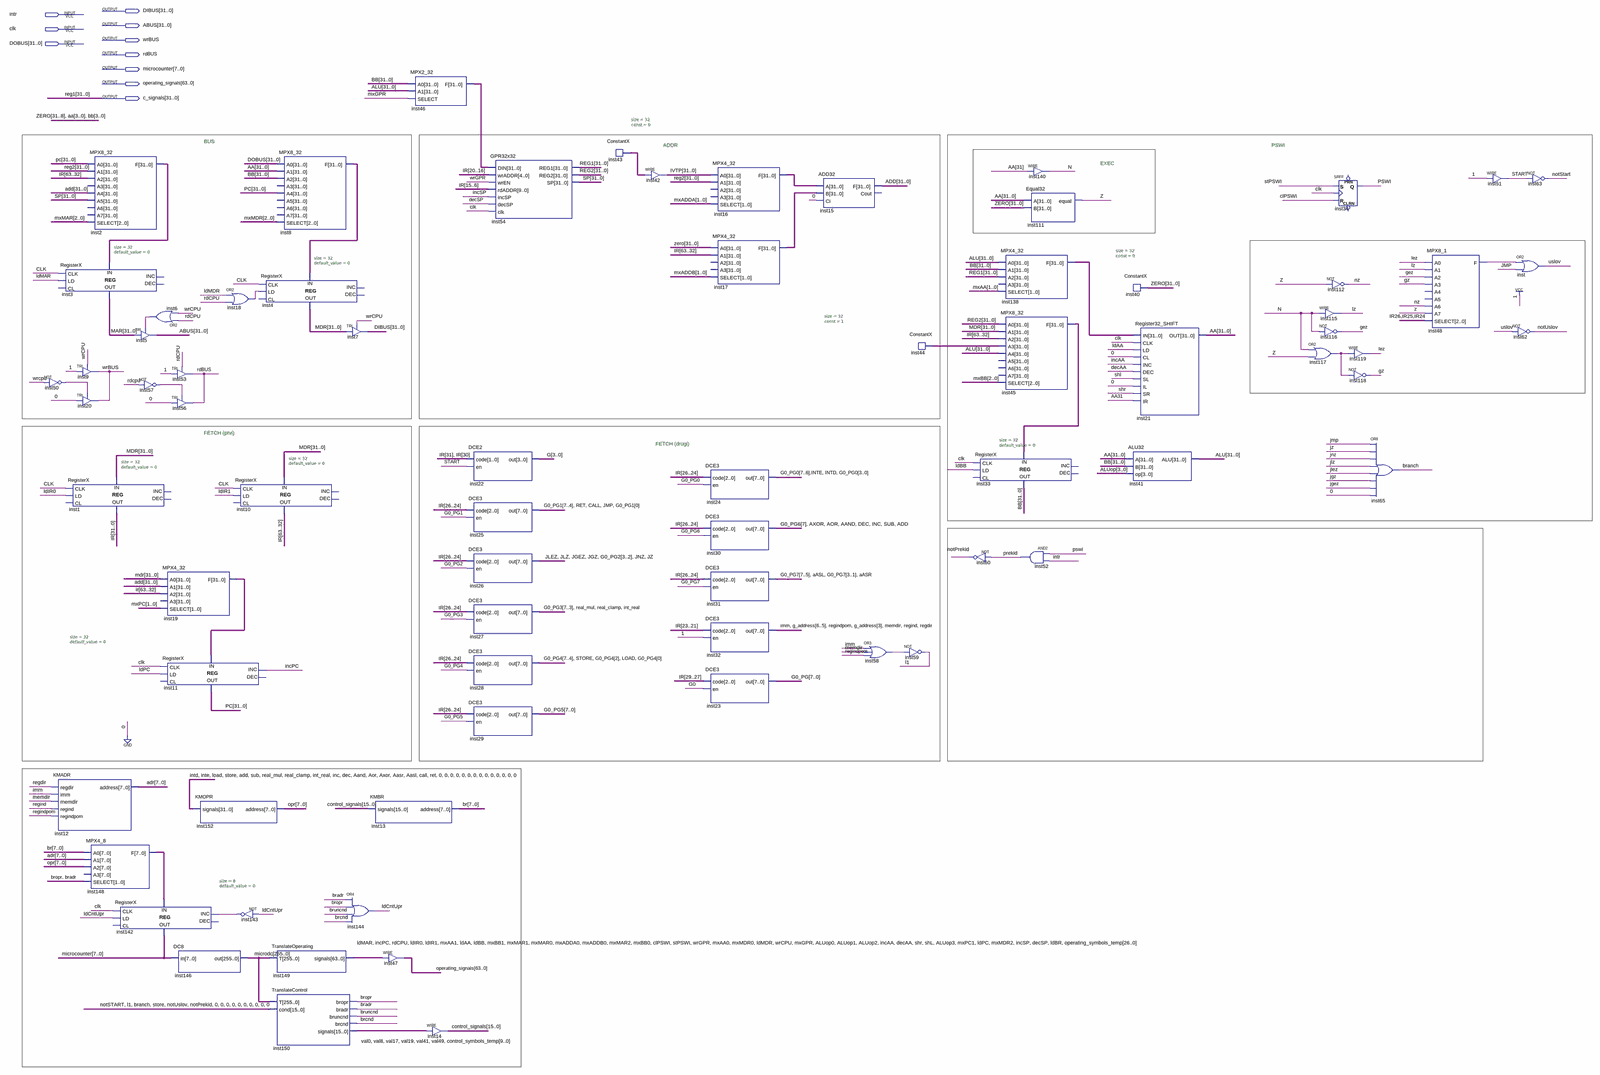
[diagram p0: schematic sheet, whole]
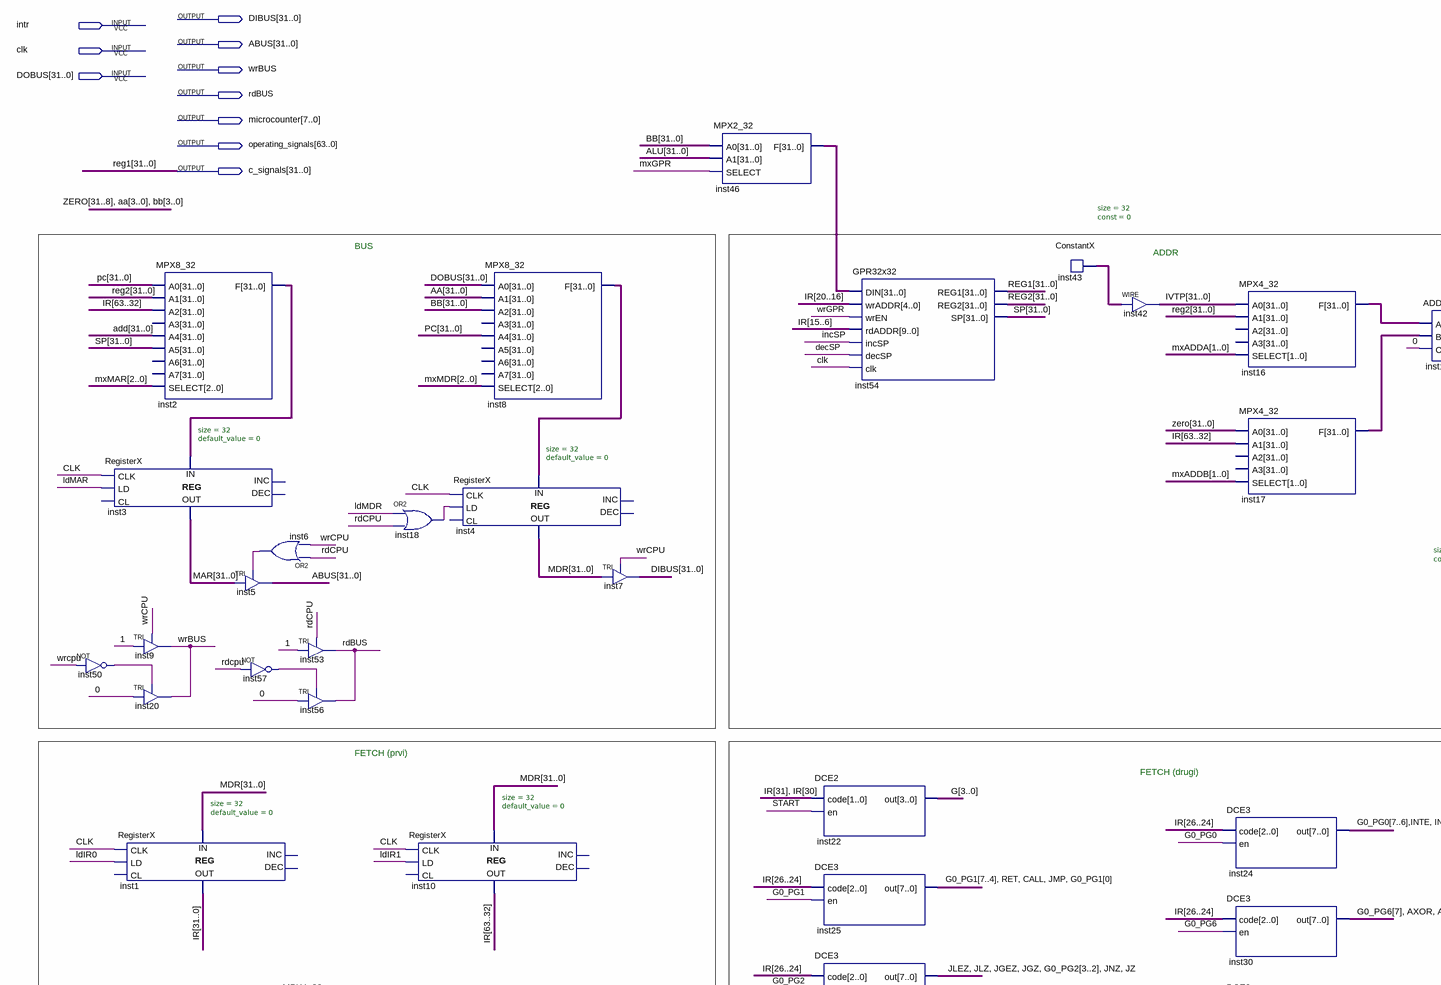
[diagram p1: schematic sheet, upper left part]
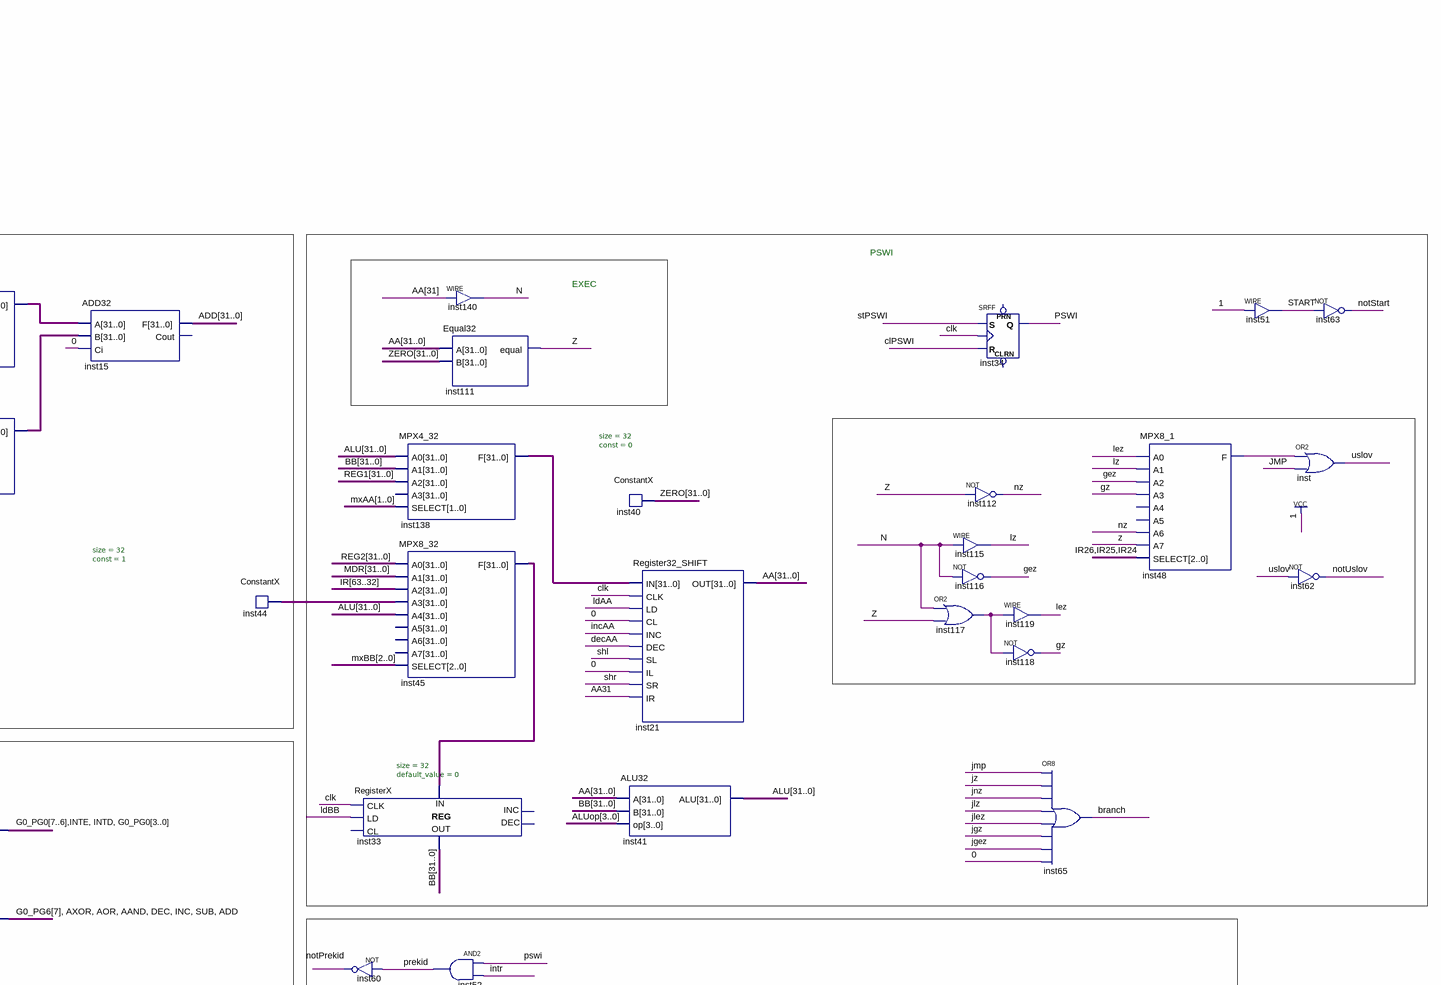
[diagram p2: schematic sheet, upper right part]
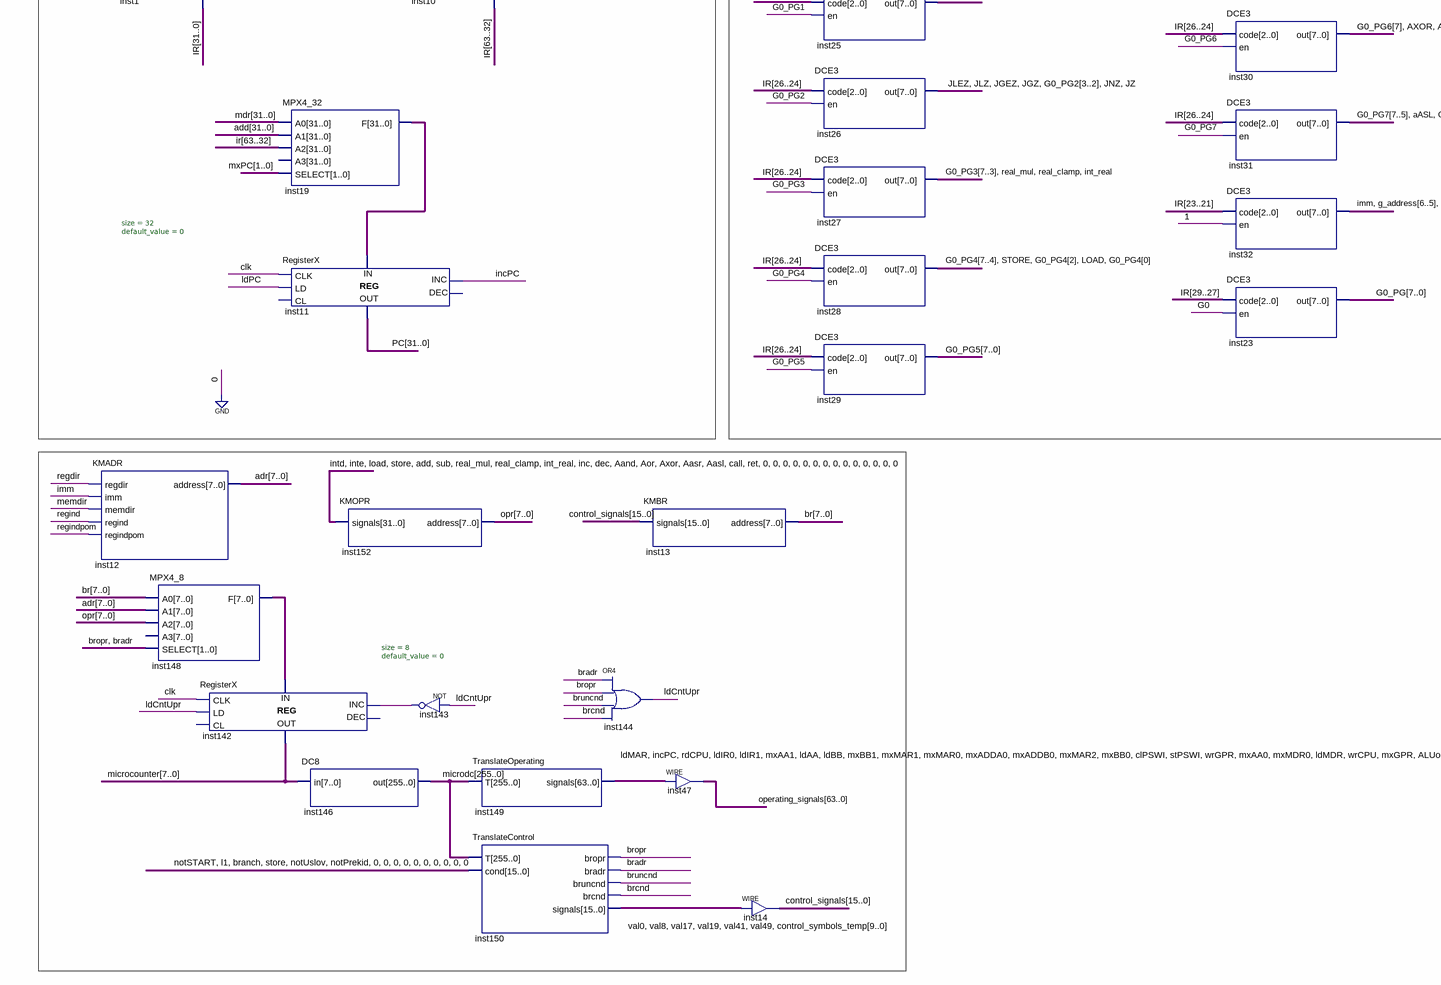
[diagram p3: schematic sheet, lower left part]
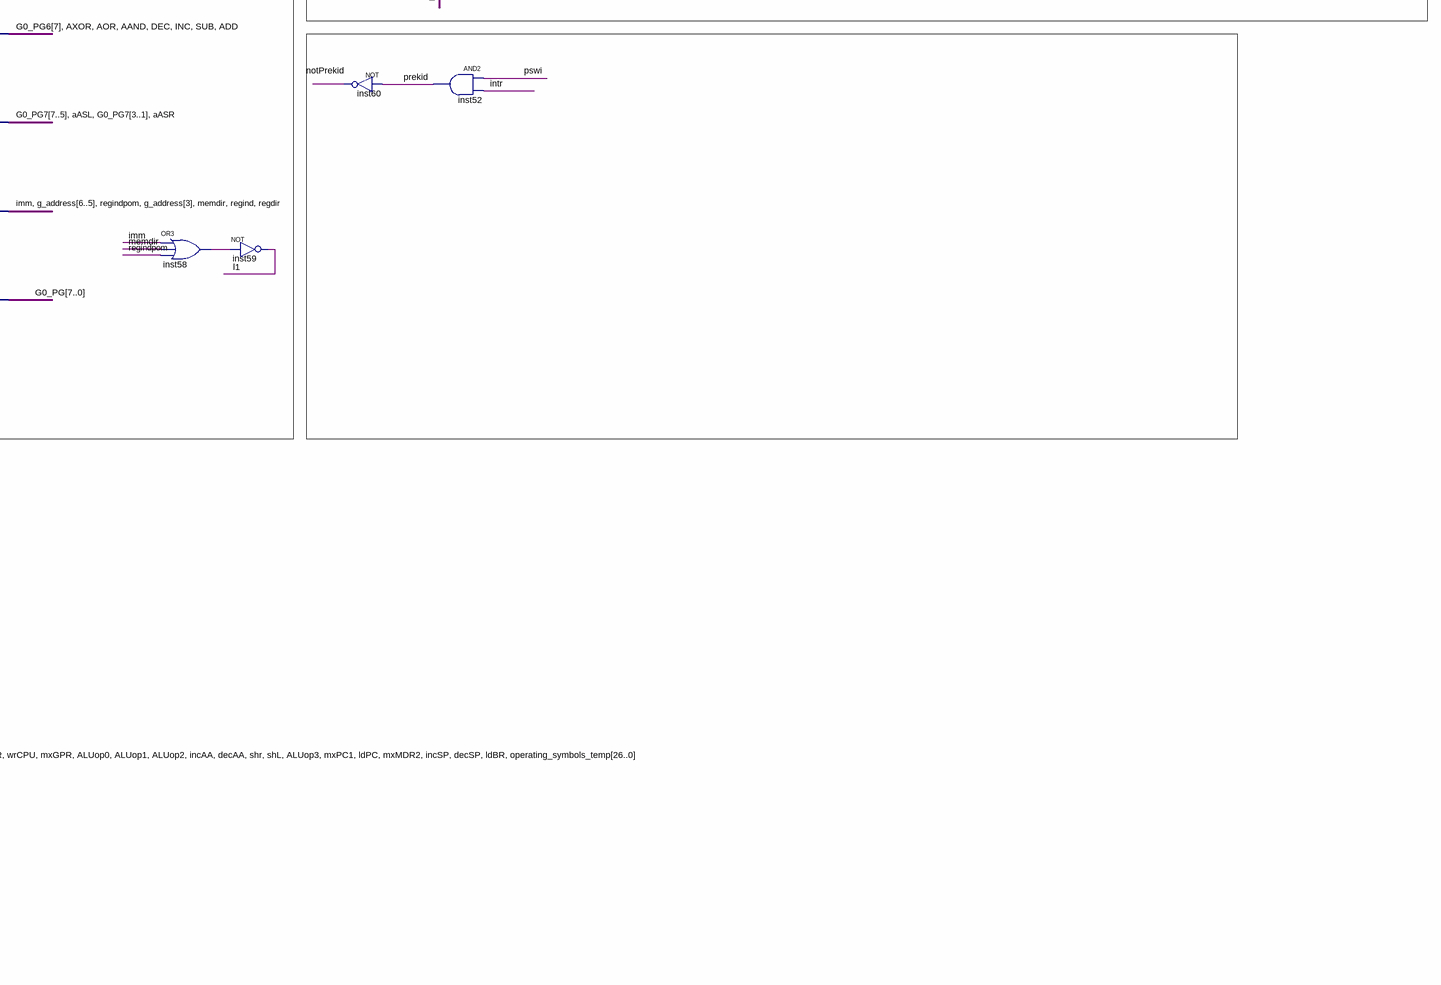
[diagram p4: schematic sheet, lower right part]
// Quartus schematic CPU.bdf as structural Verilog: 74 symbols, 10 pins
module CPU (
  input  intr,
  input  clk,
  input  [31:0] DOBUS,
  output [31:0] DIBUS,
  output [31:0] ABUS,
  output wrBUS,
  output rdBUS,
  output [7:0] microcounter,
  output [63:0] operating_signals,
  output [31:0] c_signals
);

  wire AAND, aASL, aASR, add_1bit, AOR, AXOR, bradr, branch, brcnd, bropr, bruncnd, CALL, clPSWI, DEC, decAA,
       decSP, gez, gz, imm, INC, incAA, incPC, incSP, inst6_out, inst18_out, inst48_f, inst50_out,
       inst57_out, inst58_out, inst117_out, inst143_out, int_real, INTD, INTE, JGEZ, JGZ, JLEZ, JLZ, JMP,
       JNZ, JZ, l1, ldAA, ldBB, ldBR, ldCntUpr, ldIR0, ldIR1, ldMAR, ldMDR, ldPC, lez, LOAD, lz, memdir,
       mxGPR, N, notPrekid, notStart, notUslov, nz, prekid, PSWI, rdCPU, real_clamp, real_mul, regdir,
       regind, regindpom, RET, shl, shr, START, STORE, stPSWI, SUB, uslov, val0, val8, val17, val19, val41,
       val49, wrCPU, wrGPR, Z;
  wire [1:0] mxAA, mxADDA, mxADDB, mxPC;
  wire [2:0] mxBB, mxMAR, mxMDR;
  wire [3:0] ALUop, G;
  wire [3:2] G0_PG2;
  wire [6:3] g_address;
  wire [7:0] adr, br, G0_PG, G0_PG0, G0_PG1, G0_PG4, G0_PG5, inst148_f, opr;
  wire [7:1] G0_PG7;
  wire [7:3] G0_PG3;
  wire [7:7] G0_PG6;
  wire [9:0] control_symbols_temp;
  wire [15:0] control_signals;
  wire [26:0] operating_symbols_temp;
  wire [31:0] AA, add, ALU, BB, inst2_f, inst8_f, inst16_f, inst17_f, inst19_f, inst43_data_out,
       inst44_data_out, inst45_f, inst46_f, inst138_f, IVTP, MAR, MDR, PC, REG2, SP, ZERO;
  wire [63:0] IR;
  wire [255:0] microdc;

  RegisterX #(.size(32), .default_value(0)) inst3 (
    .CLK(clk), .LD(ldMAR), .DATA_IN(inst2_f), .DATA_OUT(MAR));  // open: CL, INC, DEC
  not inst50 (inst50_out, wrCPU);
  RegisterX #(.size(32), .default_value(0)) inst1 (
    .CLK(clk), .LD(ldIR0), .DATA_IN(MDR), .DATA_OUT(IR[31:0]));  // open: CL, INC, DEC
  KMADR inst12 (.regdir(regdir), .imm(imm), .memdir(memdir), .regind(regind), .regindpom(regindpom), .address(adr));
  MPX8_32 inst2 (
    .A0(PC), .A1(REG2), .A2(IR[63:32]), .A4(add), .A5(SP), .SELECT(mxMAR), .F(inst2_f));  // open: A3, A6, A7
  TRI inst9 (.IN(1'b1), .OE(wrCPU), .OUT(wrBUS));
  TRI inst20 (.IN(1'b0), .OE(inst50_out), .OUT(wrBUS));
  MPX4_8 inst148 (.A0(br), .A1(adr), .A2(opr), .SELECT({bropr, bradr}), .F(inst148_f));  // open: A3
  RegisterX #(.size(8), .default_value(0)) inst142 (
    .CLK(clk), .LD(ldCntUpr), .INC(inst143_out), .DATA_IN(inst148_f), .DATA_OUT(microcounter));  // open: CL, DEC
  or inst6 (inst6_out, rdCPU, wrCPU);
  TRI inst5[31:0] (.IN(MAR), .OE(inst6_out), .OUT(ABUS));
  not inst57 (inst57_out, rdCPU);
  TRI inst53 (.IN(1'b1), .OE(rdCPU), .OUT(rdBUS));
  TRI inst56 (.IN(1'b0), .OE(inst57_out), .OUT(rdBUS));
  MPX4_32 inst19 (.A0(MDR), .A1(add), .A2(IR[63:32]), .SELECT(mxPC), .F(inst19_f));  // open: A3
  RegisterX #(.size(32), .default_value(0)) inst11 (
    .CLK(clk), .LD(ldPC), .INC(incPC), .DATA_IN(inst19_f), .DATA_OUT(PC));  // open: CL, DEC
  DC8 inst146 (.in(microcounter), .out(microdc));
  KMOPR inst152 (
    .signals({INTD, INTE, LOAD, STORE, add_1bit, SUB, real_mul, real_clamp, int_real, INC, DEC, AAND, AOR, AXOR, aASR, aASL, CALL, RET, {14{1'b0}}}),
    .address(opr));
  or inst18 (inst18_out, ldMDR, rdCPU);
  RegisterX #(.size(32), .default_value(0)) inst10 (
    .CLK(clk), .LD(ldIR1), .DATA_IN(MDR), .DATA_OUT(IR[63:32]));  // open: CL, INC, DEC
  not inst143 (inst143_out, ldCntUpr);
  RegisterX #(.size(32), .default_value(0)) inst4 (
    .CLK(clk), .LD(inst18_out), .DATA_IN(inst8_f), .DATA_OUT(MDR));  // open: CL, INC, DEC
  TranslateOperating inst149 (
    .T(microdc),
    .signals({ldMAR, incPC, rdCPU, ldIR0, ldIR1, mxAA[1], ldAA, ldBB, mxBB[1], mxMAR[1:0], mxADDA[0], mxADDB[0], mxMAR[2], mxBB[0], clPSWI, stPSWI, wrGPR, mxAA[0], mxMDR[0], ldMDR, wrCPU, mxGPR, ALUop[0], ALUop[1], ALUop[2], incAA, decAA, shr, shl, ALUop[3], mxPC[1], ldPC, mxMDR[2], incSP, decSP, ldBR, operating_symbols_temp}));
  TranslateControl inst150 (
    .T(microdc), .cond({notStart, l1, branch, STORE, notUslov, notPrekid, {10{1'b0}}}), .bropr(bropr),
    .bradr(bradr), .bruncnd(bruncnd), .brcnd(brcnd),
    .signals({val0, val8, val17, val19, val41, val49, control_symbols_temp}));
  MPX8_32 inst8 (.A0(DOBUS), .A1(AA), .A2(BB), .A4(PC), .SELECT(mxMDR), .F(inst8_f));  // open: A3, A5, A6, A7
  TRI inst7[31:0] (.IN(MDR), .OE(wrCPU), .OUT(DIBUS));
  or inst144 (ldCntUpr, bradr, bropr, bruncnd, brcnd);
  KMBR inst13 (.signals(control_signals), .address(br));
  assign operating_signals = {ldMAR, incPC, rdCPU, ldIR0, ldIR1, mxAA[1], ldAA, ldBB, mxBB[1], mxMAR[1:0], mxADDA[0], mxADDB[0], mxMAR[2], mxBB[0], clPSWI, stPSWI, wrGPR, mxAA[0], mxMDR[0], ldMDR, wrCPU, mxGPR, ALUop[0], ALUop[1], ALUop[2], incAA, decAA, shr, shl, ALUop[3], mxPC[1], ldPC, mxMDR[2], incSP, decSP, ldBR, operating_symbols_temp};  // WIRE inst47
  MPX2_32 inst46 (.A0(BB), .A1(ALU), .SELECT(mxGPR), .F(inst46_f));
  assign control_signals = {val0, val8, val17, val19, val41, val49, control_symbols_temp};  // WIRE inst14
  DCE2 inst22 (.code(IR[31:30]), .en(START), .out(G));
  DCE3 inst25 (.code(IR[26:24]), .en(G0_PG[1]), .out({G0_PG1[7:4], RET, CALL, JMP, G0_PG1[0]}));
  DCE3 inst26 (.code(IR[26:24]), .en(G0_PG[2]), .out({JLEZ, JLZ, JGEZ, JGZ, G0_PG2, JNZ, JZ}));
  DCE3 inst27 (.code(IR[26:24]), .en(G0_PG[3]), .out({G0_PG3, real_mul, real_clamp, int_real}));
  DCE3 inst28 (.code(IR[26:24]), .en(G0_PG[4]), .out({G0_PG4[7:4], STORE, G0_PG4[2], LOAD, G0_PG4[0]}));
  DCE3 inst29 (.code(IR[26:24]), .en(G0_PG[5]), .out(G0_PG5));
  GPR32x32 inst54 (
    .DIN(inst46_f), .wrADDR(IR[20:16]), .wrEN(wrGPR), .rdADDR(IR[15:6]), .incSP(incSP), .decSP(decSP),
    .clk(clk), .REG1(c_signals), .REG2(REG2), .SP(SP));
  ConstantX #(.size(32), .\const (0)) inst43 (.DATA_OUT(inst43_data_out));
  assign IVTP = inst43_data_out;  // WIRE inst42
  MPX4_32 inst16 (.A0(IVTP), .A1(REG2), .SELECT(mxADDA), .F(inst16_f));  // open: A2, A3
  MPX4_32 inst17 (.A0(ZERO), .A1(IR[63:32]), .SELECT(mxADDB), .F(inst17_f));  // open: A2, A3
  DCE3 inst24 (.code(IR[26:24]), .en(G0_PG[0]), .out({G0_PG0[7:6], INTE, INTD, G0_PG0[3:0]}));
  DCE3 inst30 (.code(IR[26:24]), .en(G0_PG[6]), .out({G0_PG6[7], AXOR, AOR, AAND, DEC, INC, SUB, add_1bit}));
  DCE3 inst31 (.code(IR[26:24]), .en(G0_PG[7]), .out({G0_PG7[7:5], aASL, G0_PG7[3:1], aASR}));
  DCE3 inst32 (
    .code(IR[23:21]), .en(1'b1), .out({imm, g_address[6:5], regindpom, g_address[3], memdir, regind, regdir}));
  DCE3 inst23 (.code(IR[29:27]), .en(G[0]), .out(G0_PG));
  ADD32 inst15 (.A(inst16_f), .B(inst17_f), .Ci(1'b0), .F(add));  // open: Cout
  or inst58 (inst58_out, imm, memdir, regindpom);
  ConstantX #(.size(32), .\const (1)) inst44 (.DATA_OUT(inst44_data_out));
  not inst59 (l1, inst58_out);
  RegisterX #(.size(32), .default_value(0)) inst33 (
    .CLK(clk), .LD(ldBB), .DATA_IN(inst45_f), .DATA_OUT(BB));  // open: CL, INC, DEC
  not inst60 (notPrekid, prekid);
  MPX4_32 inst138 (.A0(ALU), .A1(BB), .A2(c_signals), .SELECT(mxAA), .F(inst138_f));  // open: A3
  MPX8_32 inst45 (
    .A0(REG2), .A1(MDR), .A2(IR[63:32]), .A3(inst44_data_out), .A4(ALU), .SELECT(mxBB), .F(inst45_f));  // open: A5, A6, A7
  assign N = AA[31];  // WIRE inst140
  Equal32 inst111 (.A(AA), .B(ZERO), .equal(Z));
  and inst52 (prekid, PSWI, intr);
  ConstantX #(.size(32), .\const (0)) inst40 (.DATA_OUT(ZERO));
  Register32_SHIFT inst21 (
    .IN(inst138_f), .CLK(clk), .LD(ldAA), .CL(1'b0), .INC(incAA), .DEC(decAA), .SL(shl), .IL(1'b0), .SR(shr),
    .IR(AA[31]), .OUT(AA));
  ALU32 inst41 (.A(AA), .B(BB), .op(ALUop), .ALU(ALU));
  assign lz = N;  // WIRE inst115
  not inst116 (gez, N);
  or inst117 (inst117_out, N, Z);
  SRFF inst34 (.S(stPSWI), .R(clPSWI), .CLK(clk), .Q(PSWI));  // open: PRN, CLRN
  not inst112 (nz, Z);
  assign lez = inst117_out;  // WIRE inst119
  not inst118 (gz, inst117_out);
  or inst65 (branch, JMP, JZ, JNZ, JLZ, JLEZ, JGZ, JGEZ, 1'b0);
  MPX8_1 inst48 (
    .A0(lez), .A1(lz), .A2(gez), .A3(gz), .A6(nz), .A7(Z), .SELECT(IR[26:24]), .F(inst48_f));  // open: A4, A5
  assign START = 1'b1;  // WIRE inst51
  not inst63 (notStart, START);
  or inst (uslov, inst48_f, JMP);
  not inst62 (notUslov, uslov);

  // Other names for the same wires on the sheet: REG1[31:0] = c_signals

  // Notes on the sheet:
  //   BUS
  //   ADDR
  //   PSWI
  //   EXEC
  //   FETCH (prvi)
  //   FETCH (drugi)
endmodule
